# EAGLE schematic schematic_esp8266_oled_SI47XX_ALL_IN_ONE_menu (EAGLE 9.6.2)
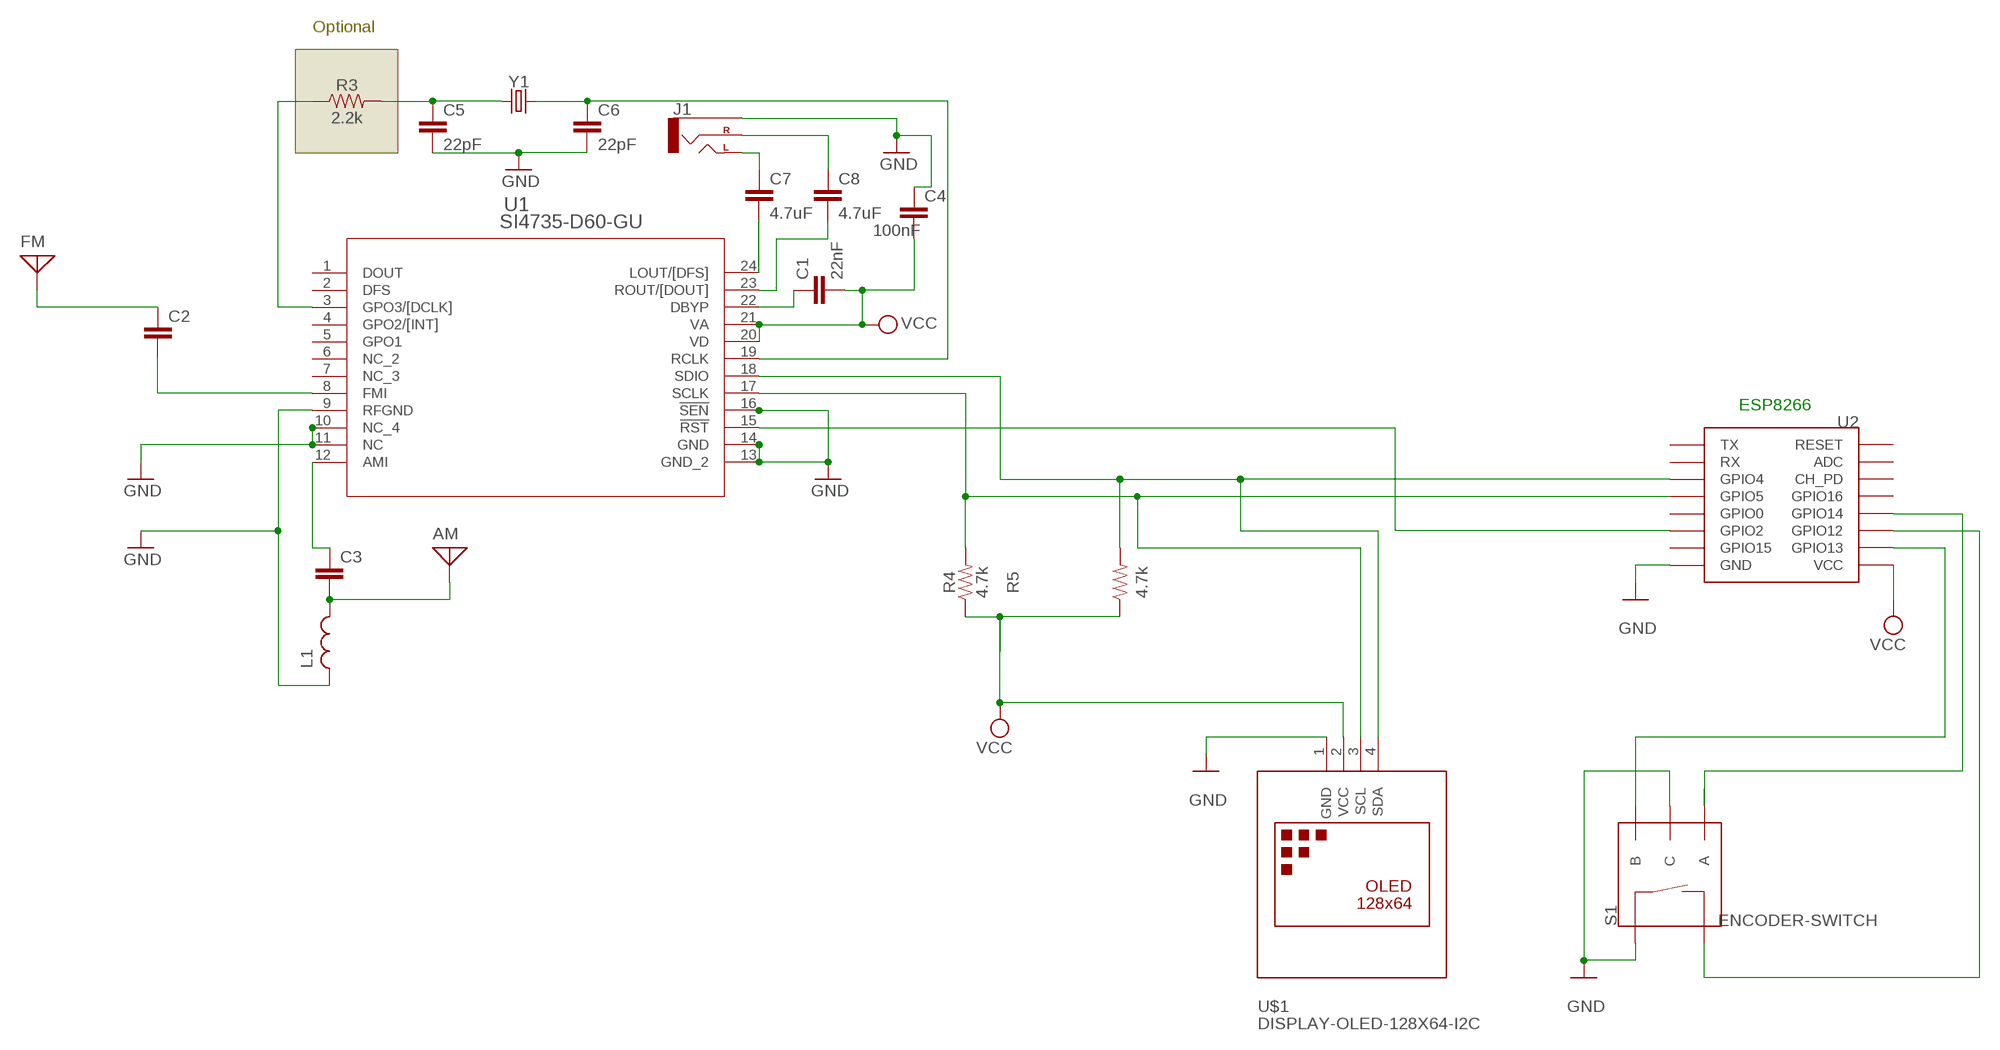
[diagram p0: schematic, sheet 1]

## Parts
AM  ANTENNA  [PAD-01]
C1  22nF  22NF/22,000PF-0603-50V-10%  [0603]
C2  CXXC10B6  [XC10B6]
C3  CXXC10B6  [XC10B6]
C4  100nF  CXXC10B6  [XC10B6]
C5  22pF  22PF-0603-50V-5%  [0603]
C6  22pF  22PF-0603-50V-5%  [0603]
C7  4.7uF  4.7UF-1206-16V-(+80/-20%)  [1206]
C8  4.7uF  4.7UF-1206-16V-(+80/-20%)  [1206]
FM  ANTENNA  [PAD-01]
J1  AUDIO_JACK_2.5MMSPECIAL_POGO_PINS  [STEREOJACK2.5MM_SPECIAL_POGOPINS]
L1  L  (no package)
R3  2.2k  2.2KOHM-0603-1/10W-1%  [0603]
R4  4.7k  4.7KOHM-0603-1/10W-1%  [0603]
R5  4.7k  4.7KOHM-0603-1/10W-1%  [0603]
S1  ENCODER-SWITCH  [ROTARY_ENC_PLAIN]
U1  SI4735-D60-GU  [SSOP24_SIL]
U2  ESP12SMD  [ESP12-SMD]
U$1  DISPLAY-OLED-128X64-I2C  [DISPLAY-OLED-128X64-I2C]
Y1  CRYSTALPTH-2X6  [CRYSTAL-PTH-2X6-CYL]

## Nets
GND: C4.1 C5.2 C6.2 J1.RING1(SLEEVE) L1.1 S1.C S1.SW+ U1.9(RFGND) U1.10(NC_4) U1.11(NC) U1.13(GND_2) U1.14(GND) U1.16(!SEN) U2.GND U$1.1(GND)
N$1: U1.15(!RST) U2.GPIO2
N$2: R5.2 U1.18(SDIO) U2.GPIO4 U$1.4(SDA)
N$3: C6.1 U1.19(RCLK) Y1.2
N$4: C1.1 U1.22(DBYP)
N$5: R3.1 U1.3(GPO3/[DCLK])
N$6: C7.2 U1.24(LOUT/[DFS])
N$7: C8.2 U1.23(ROUT/[DOUT])
N$8: C7.1 J1.SHIELD(LEFT)
N$9: C8.1 J1.TIP(RIGHT)
N$10: AM.1 C3.2 L1.2
N$11: C5.1 R3.2 Y1.1
N$12: C3.1 U1.12(AMI)
N$13: C2.2 U1.8(FMI)
N$14: C2.1 FM.1
N$15: S1.B U2.GPIO13
N$17: S1.A U2.GPIO14
N$19: S1.SW- U2.GPIO12
SDA: R4.2 U1.17(SCLK) U2.GPIO5 U$1.3(SCL)
VCC: C1.2 C4.2 R4.1 R5.1 U1.20(VD) U1.21(VA) U2.VCC U$1.2(VCC)
Unconnected: U1.1(DOUT) U1.2(DFS) U1.4(GPO2/[INT]) U1.5(GPO1) U1.6(NC_2) U1.7(NC_3) U2.ADC U2.CH_PD U2.GPIO0 U2.GPIO15 U2.GPIO16 U2.RESET U2.RXD0(RX) U2.TXD0(TX)

## Notes on the sheet
- Optional
- ESP8266

## Library data of the parts
AM FM = discrete:ANTENNA: Antenna
C1 = SparkFun-Capacitors:22NF/22,000PF: 0.022uF/22nF/22,000pF ceramic capacitors A capacitor is a passive two-terminal electrical component used to store electrical energy temporarily in an electric field.; PROD_ID: CAP-07885
C2-C4 = rcl:CX: X CAPACITOR for power line; SPICEPREFIX: C
C5 C6 = SparkFun-Capacitors:22PF: 22pF ceramic capacitors A capacitor is a passive two-terminal electrical component used to store electrical energy temporarily in an electric field.; PROD_ID: CAP-07876
C7 C8 = SparkFun-Capacitors:4.7UF: 4.7µF ceramic capacitors A capacitor is a passive two-terminal electrical component used to store electrical energy temporarily in an electric field.; PROD_ID: CAP-10300
J1 = SparkFun-Connectors:AUDIO_JACK_2.5MM: Audio Jack 2.5mm variants of PTH and SMT audio jacks. SparkFun Products: SparkFun PicoBoard <https://www.sparkfun.com/products/11888>- 2.5mm SMD
L1 = ngspice-simulation:L: INDUCTOR
R3 = SparkFun-Resistors:2.2KOHM: 2.2kΩ resistor A resistor is a passive two-terminal electrical component that implements electrical resistance as a circuit element. Resistors act to reduce current flow, and, at the same time, act to lower voltage levels within circuits. - Wikipedia; PROD_ID: RES-08272
R4 R5 = SparkFun-Resistors:4.7KOHM: 4.7kΩ resistor A resistor is a passive two-terminal electrical component that implements electrical resistance as a circuit element. Resistors act to reduce current flow, and, at the same time, act to lower voltage levels within circuits. - Wikipedia; PROD_ID: RES-07857
S1 = SparkFun-Switches:ENCODER-SWITCH: Rotary Encoder w/ Select Switch Encoders rotate similarly to potentiometers, but they’re different from potentiometers in that an encoder has full rotation without limits. They output gray code so that you can tell how much and in which direction the encoder has been turned. This encoder includes a push-down select switch built into the shaft. SparkFun Products Rotary Encoder <https://www.sparkfun.com/products/9117> (COM-09117); SF_SKU: COM-09117
U1 = si4735:SI4735-D60-GU; BUILT_BY: EMA_Cory; COPYRIGHT: Copyright (C) 2018 Accelerated Designs. All rights reserved; DATASHEET: https://www.silabs.com/documents/public/data-sheets/Si4730-31-34-35-D60.pdf; MANUFACTURER_PART_NUMBER: SI4735-D60-GU; SOURCELIBRARY: Silicon_Labs_2020-04-23; VENDOR: Silicon Labs
U2 = esp8266modules:ESP12: ESP8266 Wifi module 12
U$1 = diy-modules:DISPLAY-OLED-128X64-I2C: 128x64 Dot Matrix OLED Module based on SSD1306 chip Variant with I2C interface More details available here: http://www.instructables.com/id/Monochrome-096-i2c-OLED-display-with-arduino-SSD13/ SSD1306 datasheet: https://cdn-shop.adafruit.com/datasheets/SSD1306.pdf Click here to find device on ebay.com <http://www.ebay.com/sch/oled+display+128x64+iic> Note: There are two variants: I2C and SPI. Search for the proper version.
Y1 = SparkFun-Clocks:CRYSTAL: Crystals (Generic) These are passive quartz crystals, which can be used as a clock source for a microcontroller. Crystal's are two-terminal devices. They require external "load" capacitors to generate an oscillating signal.